# Altium schematic sheet schematic.SchDoc
size A4; Date: Date: 19/11/2024; ApprovedBy: ApprovedBy; CheckedBy: CheckBy:; DrawnBy: Design by: NGUYỄN CÔNG HÙNG; DocumentNumber: Document No: 0001; Revision: Revision: 1.0; SheetNumber: Sheet: 1 of 1; SheetTotal: Sheet: 1 of 1; DocumentName: Document No: 0001
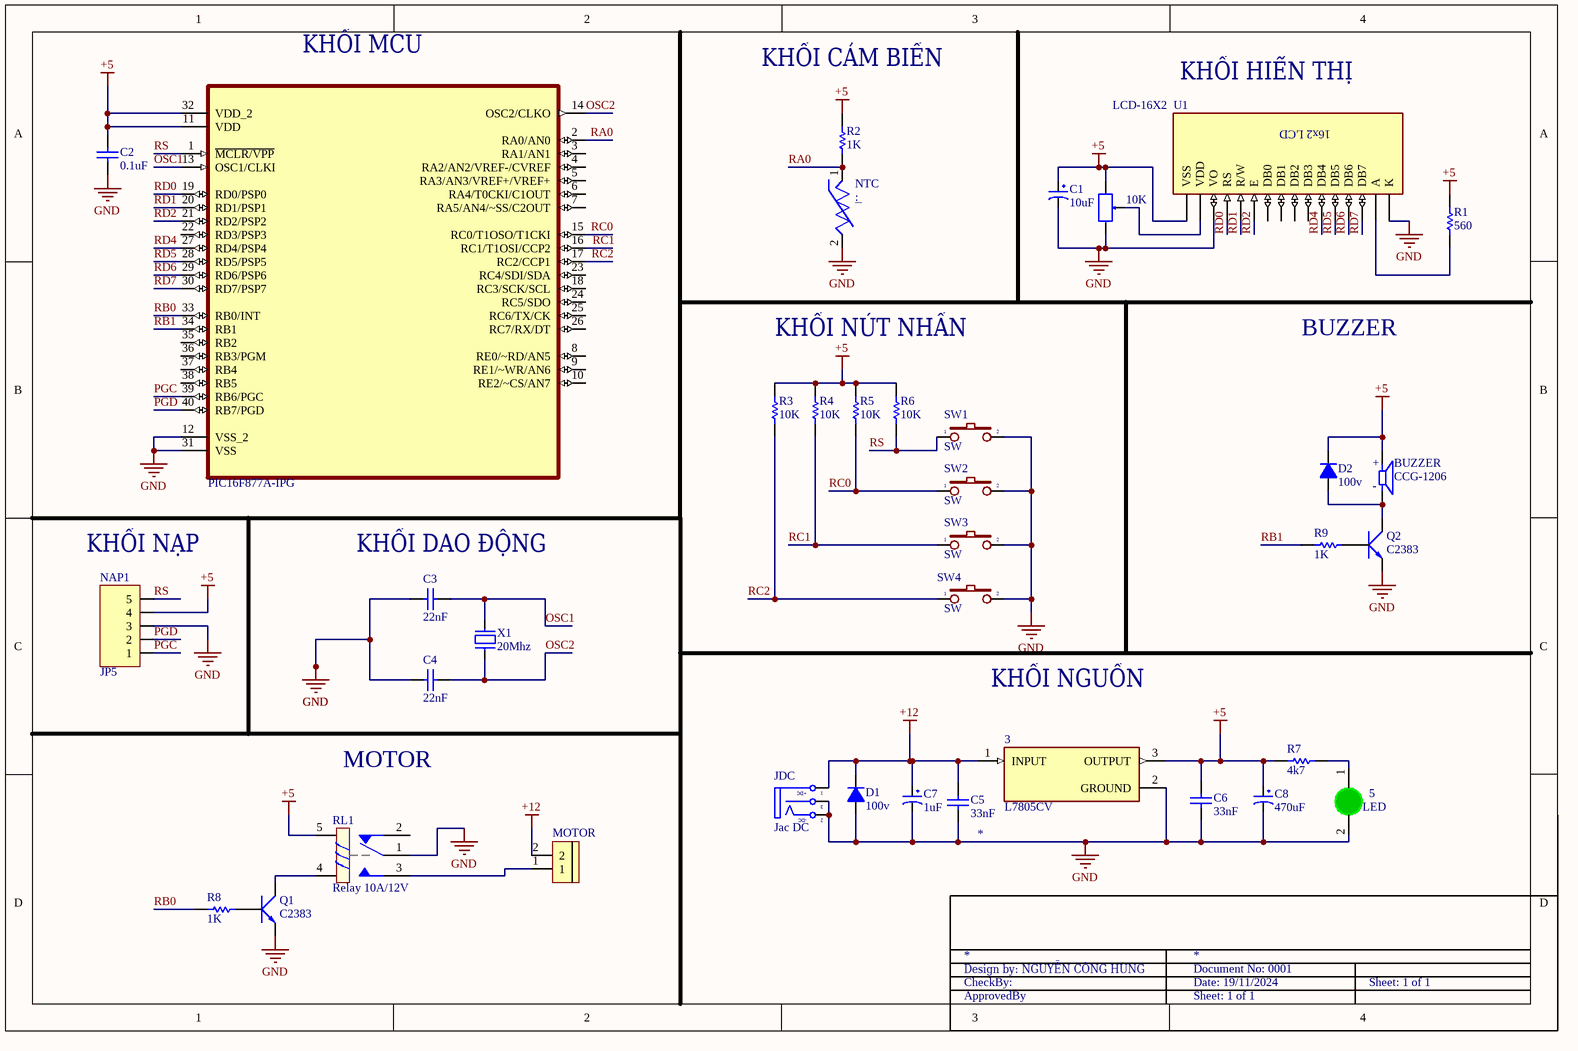
[diagram p0: schematic.SchDoc]

## Parts
(Parts that share a designator on the sheet are numbered #1, #2 ... from top to bottom, then left to right.)
3  L7805CV  [TO255P1040X460X1968-3]
5  LED  [LED-3MM-GREEN]
?#1  10K  [B10K]
?#2  PIC16F877A-IPG  [DIP254P1524X483-40]
BUZZER  CCG-1206  [PCBComponent_1]
C1  10uF  [tu hoa 5mm]
C2  0.1uF  [tu gom]
C3  22nF  [tu gom]
C4  22nF  [tu gom]
C5  33nF  [tu gom]
C6  33nF  [tu gom]
C7  1uF  [tu hoa 5mm]
C8  470uF  [tu hoa 5mm]
D1  100v  [DIODE 1A]
D2  100v  [DIODE 1A]
JDC  Jac DC  [DC-IN]
MOTOR  (no value)  [CON 2 2EDG5.08]
NAP1  JP5  [JP5-C1T]
NTC  GA1K2A1  [PCBComponent_1]  (value not drawn)
Q1  C2383  [QTO-92]
Q2  C2383  [QTO-92]
R1  value 560  [R1/4W]  (hidden comment: Res1)
R2  value 1K  [R1/4W]  (hidden comment: Res1)
R3  value 10K  [R1/4W]  (hidden comment: Res1)
R4  value 10K  [R1/4W]  (hidden comment: Res1)
R5  value 10K  [R1/4W]  (hidden comment: Res1)
R6  value 10K  [R1/4W]  (hidden comment: Res1)
R7  value 4k7  [R1/4W]  (hidden comment: Res1)
R8  value 1K  [R1/4W]  (hidden comment: Res1)
R9  value 1K  [R1/4W]  (hidden comment: Res1)
RL1  Relay 10A/12V  [RELAY 5]
SW1  SW  [SW2]
SW2  SW  [SW2]
SW3  SW  [SW2]
SW4  SW  [SW2]
U1  LCD-16X2  [MODULE_LCD-16X2]
X1  20Mhz  [XT2]

## Nets
+5: 3.3(OUTPUT) ?#1.1 ?#2.11(VDD) ?#2.32(VDD_2) BUZZER.P C1.1 C2.1 C6.2 C8.1 D2.2(K) NAP1.4 R1.2 R2.1 R3.1 R4.1 R5.1 R6.1 R7.2 RL1.5 U1.1(VSS)
+12: 3.1(INPUT) C5.1 C7.1 D1.2(K) JDC.1(T) MOTOR.2
GND: 3.2(GROUND) 5.2(K) ?#1.3 ?#2.12(VSS_2) ?#2.31(VSS) C1.2 C2.2 C3.2 C4.2 C5.2 C6.1 C7.2 C8.2 D1.1(A) JDC.2(TN) JDC.3(S) NAP1.3 NTC.2 Q1.1(E) Q2.1(E) RL1.1 SW1.2 SW2.2 SW3.2 SW4.2 U1.3(VO) U1.16(K)
OSC1: ?#2.13(OSC1/CLKI) C3.1 X1.2
OSC2: ?#2.14(OSC2/CLKO) C4.1 X1.1
PGC: ?#2.39(RB6/PGC) NAP1.1
PGD: ?#2.40(RB7/PGD) NAP1.2
RA0: ?#2.2(RA0/AN0) NTC.1 R2.2
RB0: ?#2.33(RB0/INT) R8.2
RB1: ?#2.34(RB1) R9.2
RC0: ?#2.15(RC0/T1OSO/T1CKI) R5.2 SW2.1
RC1: ?#2.16(RC1/T1OSI/CCP2) R4.2 SW3.1
RC2: ?#2.17(RC2/CCP1) R3.2 SW4.1
RD0: ?#2.19(RD0/PSP0) U1.4(RS)
RD1: ?#2.20(RD1/PSP1) U1.5(R/W)
RD2: ?#2.21(RD2/PSP2) U1.6(E)
RD4: ?#2.27(RD4/PSP4) U1.11(DB4)
RD5: ?#2.28(RD5/PSP5) U1.12(DB5)
RD6: ?#2.29(RD6/PSP6) U1.13(DB6)
RD7: ?#2.30(RD7/PSP7) U1.14(DB7)
RS: ?#2.1(~{MCLR/VPP}) NAP1.5 R6.2 SW1.1
Net5_1: 5.1(A) R7.1
Net?#1_2: ?#1.2 U1.2(VDD)
NetBUZZER_M: BUZZER.M D2.1(A) Q2.2(C)
NetMOTOR_1: MOTOR.1 RL1.3
NetQ1_2: Q1.2(C) RL1.4
NetQ1_3: Q1.3(B) R8.1
NetQ2_3: Q2.3(B) R9.1
NetR1_1: R1.1 U1.15(A)

Not connected (* = marked no-connect by the designer): ?#2 3(RA1/AN1) 4(RA2/AN2/VREF-/CVREF) 5(RA3/AN3/VREF+/VREF+) 6(RA4/T0CKI/C1OUT) 7(RA5/AN4/~SS/C2OUT) 8(RE0/~RD/AN5) 9(RE1/~WR/AN6) 10(RE2/~CS/AN7) 18(RC3/SCK/SCL) 22(RD3/PSP3) 23(RC4/SDI/SDA) 24(RC5/SDO) 25(RC6/TX/CK) 26(RC7/RX/DT) 35(RB2) 36(RB3/PGM) 37(RB4) 38(RB5); RL1 2; U1 7(DB0) 8(DB1) 9(DB2) 10(DB3)

## Notes on the sheet
- KHỐI MCU
- KHỐI CẢM BIẾN
- KHỐI HIỂN THỊ
- KHỐI NÚT NHẤN
- BUZZER
- (near NAP1) KHỐI NẠP
- (near C3) KHỐI DAO ĐỘNG
- KHỐI NGUỒN
- MOTOR
- (in symbol CCG-1206) +; -
- (in symbol DCIN) +DC; -DC
- (in symbol LCD-16X2) 16x2 LCD

## Library data of the parts
3 = L7805CV: Linear Voltage Regulator IC Positive Fixed 1 Output 1.5A TO-220; MF: STMicroelectronics; SnapEDA_Link: https://www.snapeda.com/parts/L7805CV/STMicroelectronics/view-part/?ref=snap; Package: TO-220-3 ON Semiconductor; MP: L7805CV; Check_prices: https://www.snapeda.com/parts/L7805CV/STMicroelectronics/view-part/?ref=eda; Purchase-URL: https://pricing.snapeda.com/search/part/L7805CV/?ref=eda; Price: None; Value: *; Availability: In Stock
5 = LED 3mm Xanh La: Cắm; Don_Vi: Con; Ma_Hang: MH001054; Ten_Linh_Kien: Led 3MM Phủ Xanh (10c); Ghi_Chu: *; Kieu_Chan: *; Chung_Loai: Cắm
?#1 = Bien Tro Tinh Chinh 10K Dung: Cắm; Ma_Hang: MH003232; Ten_Linh_Kien: Biến Trở VR 103-10K 3296W; Don_Vi: Con; Kieu_Chan: *; Chung_Loai: Cắm; Ghi_Chu: *
?#2 = PIC16F877A-IPG: Mcu Cmos 40ld 20mhz 8k Flash; MF: Microchip; MP: PIC16F877A-I/PG; Price: None; Availability: Unavailable; Package: None; SnapEDA_Link: https://www.snapeda.com/parts/PIC16F877A-I/PG/Microchip/view-part/2768201/?ref=snap; Value: *
BUZZER = CCG-1206: 12 mm, 5 V, 85 dB, Through Hole, Sealed, Magnetic Audio Transducer Buzzer; Availability: Unavailable; Value: *; Package: None; MP: CCG-1206; Price: None
C1 C7 C8 = Tu Hoa 1uF 50V 5x11: Cắm; Don_Vi: Con; So_Chan: 2; Ten_Linh_Kien: Tụ Hóa 1uF 50V 5x11MM; Ma_Hang: MH001355; Chung_Loai: Cắm; Kieu_Chan: *
C2-C6 = Tu gom 222 50V: Cắm; Don_Vi: Con; So_Chan: 2; Ten_Linh_Kien: Tụ gốm 222-2.2nF 50V; Ma_Hang: MH004770; Chung_Loai: Cắm; Kieu_Chan: *
D1 D2 = Diode 1N4007: Cắm; Ten_Linh_Kien: Diode 1N4007 1A (DIP); Don_Vi: Con; Ma_Hang: MH001063; Ghi Chu: *; Kieu_Chan: *; Chung_Loai: Cắm
JDC = DCIN: Jac DC input; Value: Jac DC
MOTOR = CON 2 EDG5.08: Cắm; Ten_Linh_Kien: CON 2 2EDG5.08-2P 5.08MM ( Xanh Cong); Don_Vi: Con; Ma_Hang: MH000759; Ghi_Chu: *; Kieu_Chan: *; Chung_Loai: Cắm
NAP1 = JP5: WR-PHD 2.54 mm Angled Socket Header; Manufacturer: W¨¹rth Elektronik eiSos GmbH; partNo: 613005143121; ComponentLink1 Description: Manufacturer; ComponentLink2 Description: Datasheet; NoPins: 05; Created Date: 29 March 2013; ComponentLink1URL: http://www.we-online.com; ComponentLink2URL: http://katalog.we-online.de/em/datasheet/6130xx143121.pdf; Created by: Karrer Zheng
NTC = GA1K2A1: DISCRETE THERMISTOR,+/-0.2C FROM 0C TO 70C, 32 AWG; MF: TE Connectivity; Package: Epoxy Radial Discrete; Availability: Warning; Value: *; MP: GA1K2A1; SnapEDA_Link: https://www.snapeda.com/parts/GA1K2A1/TE%20Connectivity%20/%20DEUTSCH/view-part/1314624/?ref=snap; Price: None; Purchase-URL: https://pricing.snapeda.com/search/part/GA1K2A1/?ref=eda
Q1 Q2 = NPN_ECB: P 600mW, ECB; Value: C1815
R1-R9 = Res1_4: Resistor; Manufacturer: Generic Components; Class: Passive; Published: 08/06/2000; Publisher: Altium Hobart Technology Centre; SubClass: Resistor
RL1 = Relay 5: Relay SPDT,10A - 12VDC 5 Pin; Value: Relay SPDT, 10A, 12V
SW1-SW4 = SW2: Switch button 2 pin; Value: SW chip 2 pin
U1 = LCD-16X2: Display Development Tools 16x2 Black on Green Char LCD w Backlight; MF: Gravitech; Package: None; Price: None; Value: *; SnapEDA_Link: https://www.snapeda.com/parts/LCD-16X2/Gravitech/view-part/?ref=snap; MP: LCD-16X2; Availability: Not in stock; Check_prices: https://www.snapeda.com/parts/LCD-16X2/Gravitech/view-part/?ref=eda
X1 = XT2: Crystal For all Crystal 2pin.; Value: 4Mhz